# Altium schematic sheet ESP Programming_Top.SchDoc
size A
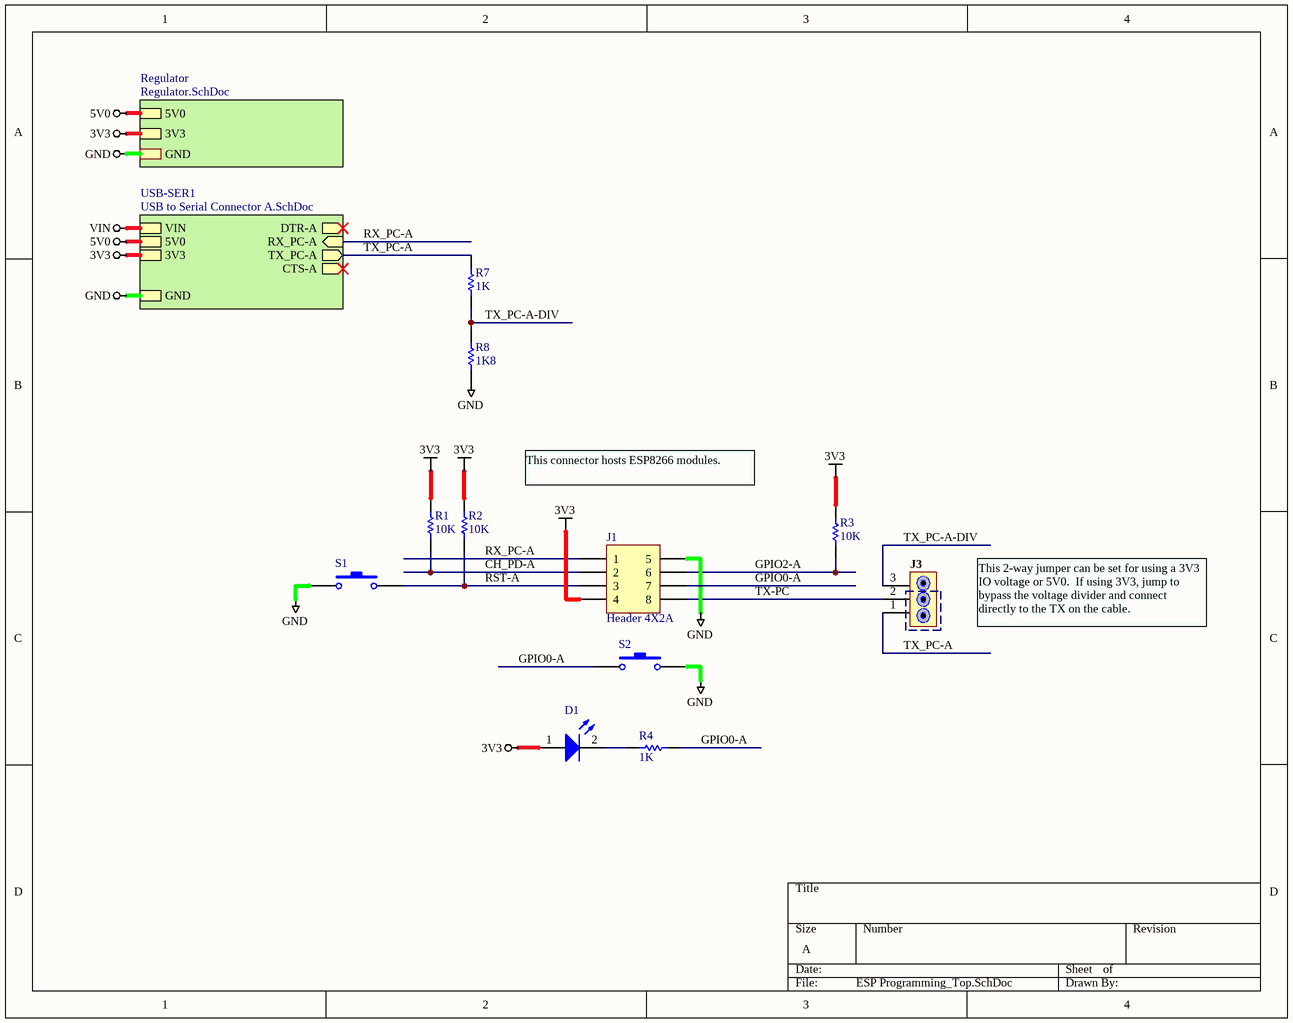
[diagram p0: ESP Programming_Top.SchDoc]

## Parts
D1  LED2  [HDR1X2]  (value not drawn)
J1  Header 4X2A  [HDR2X4_CEN]
J3  3-WAY JUMPER  [HDR1X3]  (value not drawn)
R1  value 10K  [AXIAL-0.3]  (hidden comment: Res1)
R2  value 10K  [AXIAL-0.3]  (hidden comment: Res1)
R3  value 10K  [AXIAL-0.3]  (hidden comment: Res1)
R4  value 1K  [AXIAL-0.3]  (hidden comment: Res1)
R7  value 1K  [AXIAL-0.3]  (hidden comment: Res1)
R8  value 1K8  [AXIAL-0.3]  (hidden comment: Res1)
S1  SW-PB  [NOPB-4]  (value not drawn)
S2  SW-PB  [NOPB-4]  (value not drawn)

## Sub-sheets
Regulator = Regulator.SchDoc: 5V0, 3V3, GND
USB-SER1 = USB to Serial Connector A.SchDoc: DTR-A, RX_PC-A (in), TX_PC-A (out), CTS-A, VIN, GND, 5V0, 3V3

## Nets
3V3: D1.1(A) J1.4 R1.2 R2.2 R3.2 ; sheet Regulator/3V3, sheet USB-SER1/3V3
5V0: sheet Regulator/5V0, sheet USB-SER1/5V0
GND: J1.5 R8.1 S1.1 S2.2 ; sheet Regulator/GND, sheet USB-SER1/GND
VIN: sheet USB-SER1/VIN
CH_PD-A: J1.2 R1.1
GPIO0-A: J1.7 R4.1 S2.1
GPIO2-A: J1.6 R3.1
RST-A: J1.3 R2.1 S1.2
RX_PC-A: J1.1 ; sheet USB-SER1/RX_PC-A
TX-PC: J1.8 J3.2
TX_PC-A: J3.1 R7.2 ; sheet USB-SER1/TX_PC-A
TX_PC-A-DIV: J3.3 R7.1 R8.2
NetD1_2: D1.2(K) R4.2

## Notes on the sheet
- This connector hosts ESP8266 modules.
- This 2-way jumper can be set for using a 3V3 IO voltage or 5V0.  If using 3V3, jump to bypass the voltage divider and connect directly to the TX on the cable.

## Library data of the parts
D1 = LED2: Typical RED, GREEN, YELLOW, AMBER GaAs LED; Published: 8-Jun-2000; LatestRevisionDate: 17-Jul-2002; LatestRevisionNote: Re-released for DXP Platform.; PackageVersion: Feb-2002; PackageReference: 3.2X1.6X1.1; Publisher: Altium Limited; PackageDescription: SM LED; 2 Flat Leads
J1 = Header 4X2A: Header, 4-Pin, Dual row; LatestRevisionDate: 17-Jul-2002; LatestRevisionNote: Re-released for DXP Platform.; Publisher: Altium Limited
J3 = 3-WAY JUMPER: 3-Way Jumper - Center Output
R1-R4 R7 R8 = Res1: Resistor; Published: 8-Jun-2000; LatestRevisionDate: 17-Jul-2002; LatestRevisionNote: Re-released for DXP Platform.; PackageReference: AXIAL-0.3; Publisher: Altium Limited; PackageDescription: Axial Device, Thru-Hole; 2 Leads; 0.3 in Pin Spacing
S1 S2 = SW-PB: Switch; Published: 24-Mar-1999; LatestRevisionDate: 17-Jul-2002; LatestRevisionNote: Re-released for DXP Platform.; PackageReference: SPST-2; Publisher: Altium Limited; PackageDescription: Switch; 2 Leads